# EAGLE schematic Wheel_Encoder_Adapter_Schmitt (EAGLE 6.0)
DATABASE: ./../PARTSDB.txt
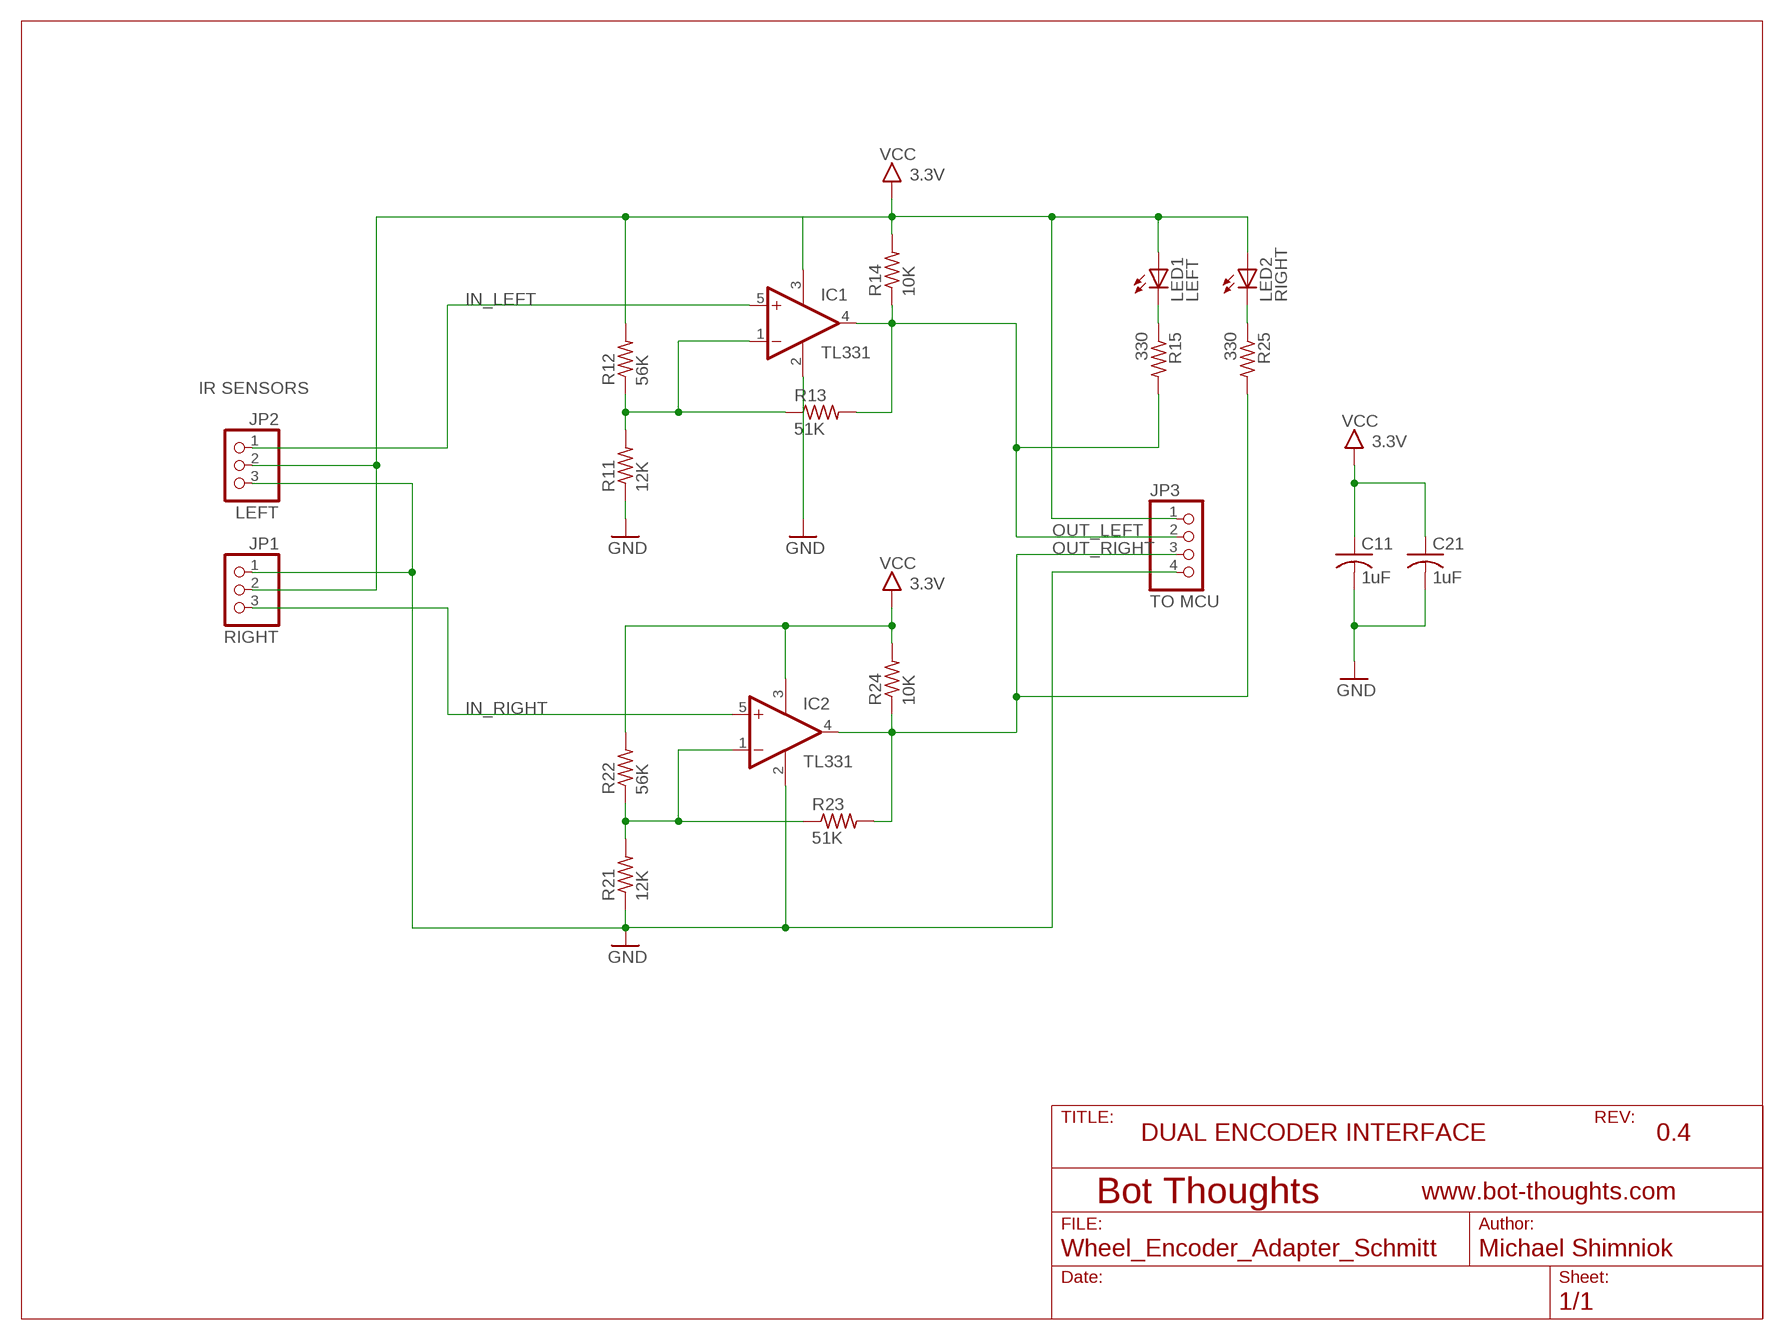
[diagram p0: schematic, sheet 1]

## Parts
C11  1uF  C-USC0603  [C0603]
C21  1uF  C-USC0603  [C0603]
IC1  TL331  [DBV-R-PDSO-G5]
IC2  TL331  [DBV-R-PDSO-G5]
JP1  RIGHT  PINHD-1X03_2.54-S  [1X03-S]
JP2  LEFT  PINHD-1X03_2.54-S  [1X03-S]
JP3  TO MCU  PINHD-1X04_2.54-S  [1X04-S]
LED1  LEFT  LEDCHIPLED_1206  [CHIPLED_1206]
LED2  RIGHT  LEDCHIPLED_1206  [CHIPLED_1206]
R11  12K  R-US_R0603  [R0603]
R12  56K  R-US_R0603  [R0603]
R13  51K  R-US_R0603  [R0603]
R14  10K  R-US_R0603  [R0603]
R15  330  R-US_R0603  [R0603]
R21  12K  R-US_R0603  [R0603]
R22  56K  R-US_R0603  [R0603]
R23  51K  R-US_R0603  [R0603]
R24  10K  R-US_R0603  [R0603]
R25  330  R-US_R0603  [R0603]

## Nets
GND: C11.2 C21.2 IC1.2(GND) IC2.2(GND) JP1.1 JP2.3 JP3.4 R11.1 R21.1
IN_LEFT: IC1.5(+IN) JP2.1
IN_RIGHT: IC2.5(+IN) JP1.3
N$1: LED1.C R15.1
N$2: IC1.1(-IN) R11.2 R12.1 R13.1
N$3: LED2.C R25.1
N$7: IC2.1(-IN) R21.2 R22.1 R23.1
OUT_LEFT: IC1.4(OUT) JP3.2 R13.2 R14.1 R15.2
OUT_RIGHT: IC2.4(OUT) JP3.3 R23.2 R24.1 R25.2
VCC: C11.1 C21.1 IC1.3(V+) IC2.3(V+) JP1.2 JP2.2 JP3.1 LED1.A LED2.A R12.2 R14.2 R22.2 R24.2 ; supply symbol labelled 3.3V

## Notes on the sheet
- IR SENSORS
- DUAL ENCODER INTERFACE | 0.4

## Library data of the parts
C11 C21 = rcl:C-US: CAPACITOR, American symbol; BOM: INCLUDE; PARTNO: C1608X7R1A105M
IC1 IC2 = linear:TL331: SINGLE DIFFERENTIAL COMPARATOR Source: http://www.ti.com .. tl331.pdf; BOM: INCLUDE; PARTNO: TL331IDBVR
JP1 JP2 = pinhead-2:PINHD-1X03: PIN HEADER
JP3 = pinhead-2:PINHD-1X04: PIN HEADER; BOM: EXCLUDE
LED1 LED2 = led:LED: LED OSRAM: - CHIPLED LG R971, LG N971, LY N971, LG Q971, LY Q971, LO R971, LY R971 LH N974, LH R974 LS Q976, LO Q976, LY Q976 LO Q996 - Hyper CHIPLED LW Q18S LB Q993, LB Q99A, LB R99A - SideLED LS A670, LO A670, LY A670, LG A670, LP A670 LB A673, LV A673, LT A673, LW A673 LH A674 LY A675 LS A676, LA A676, LO A676, LY A676, LW A676 LS A679, LY A679, LG A679 - Hyper Micro SIDELED® LS Y876, LA Y876, LO Y876, LY Y876 LT Y87S - SmartLED LW L88C, LW L88S LB L89C, LB L89S, LG L890 LS L89K, LO L89K, LY L89K LS L896, LA L896, LO L896, LY L896 - TOPLED LS T670, LO T670, LY T670, LG T670, LP T670 LSG T670, LSP T670, LSY T670, LOP T670, LYG T670 LG T671, LOG T671, LSG T671 LB T673, LV T673, LT T673, LW T673 LH T674 LS T676, LA T676, LO T676, LY T676, LB T676, LH T676, LSB T676, LW T676 LB T67C, LV T67C, LT T67C, LS T67K, LO T67K, LY T67K, LW E67C LS E67B, LA E67B, LO E67B, LY E67B, LB E67C, LV E67C, LT E67C LW T67C LS T679, LY T679, LG T679 LS T770, LO T770, LY T770, LG T770, LP T770 LB T773, LV T773, LT T773, LW T773 LH T774 LS E675, LA E675, LY E675, LS T675 LS T776, LA T776, LO T776, LY T776, LB T776 LHGB T686 LT T68C, LB T68C - Hyper Mini TOPLED® LB M676 - Mini TOPLED Santana® LG M470 LS M47K, LO M47K, LY M47K Source: http://www.osram.convergy.de LUXEON: - LUMILED® LXK2-PW12-R00, LXK2-PW12-S00, LXK2-PW14-U00, LXK2-PW14-V00 LXK2-PM12-R00, LXK2-PM12-S00, LXK2-PM14-U00 LXK2-PE12-Q00, LXK2-PE12-R00, LXK2-PE12-S00, LXK2-PE14-T00, LXK2-PE14-U00 LXK2-PB12-K00, LXK2-PB12-L00, LXK2-PB12-M00, LXK2-PB14-N00, LXK2-PB14-P00, LXK2-PB14-Q00 LXK2-PR12-L00, LXK2-PR12-M00, LXK2-PR14-Q00, LXK2-PR14-R00 LXK2-PD12-Q00, LXK2-PD12-R00, LXK2-PD12-S00 LXK2-PH12-R00, LXK2-PH12-S00 LXK2-PL12-P00, LXK2-PL12-Q00, LXK2-PL12-R00 Source: www.luxeon.com KINGBRIGHT: KA-3528ASYC Source: www.kingbright.com; BOM: INCLUDE; PARTNO: LG N971-KN-1
R11 R21 = resistor:R-US_: RESISTOR, American symbol; PARTNO: ERJ-3EKF1202V
R12 R22 = resistor:R-US_: RESISTOR, American symbol; PARTNO: ERJ-3EKF5602V
R13 R23 = resistor:R-US_: RESISTOR, American symbol; PARTNO: ERJ-3EKF5102V
R14 R24 = resistor:R-US_: RESISTOR, American symbol; PARTNO: ERJ-3GEYJ103V
R15 R25 = resistor:R-US_: RESISTOR, American symbol; PARTNO: ERJ-3GEYJ331V